# Altium schematic sheet IQModulatorWaveyRadar.SchDoc: IQ Modulator WaveyRadar Schematic
size Letter; Author: Will Vu; CompanyName: Raccoon Wireless; DrawnBy: Will Vu, Raccoon Wireless; Engineer: Will Vu; Organization: Raccoon Wireless; DocumentNumber: 2-08; Revision: 2; SheetNumber: 8; SheetTotal: 15
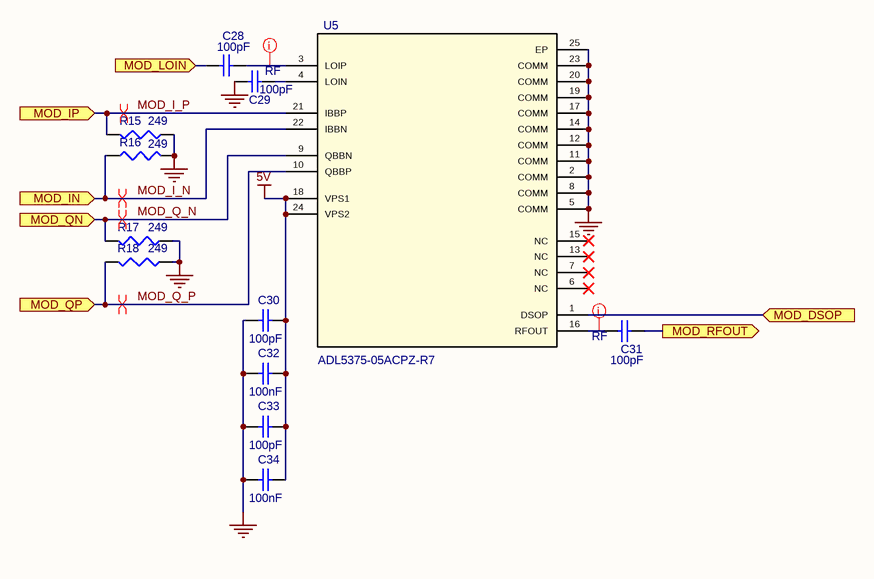
[diagram p0: IQModulatorWaveyRadar.SchDoc]

## Parts
C28  value 100pF  [CAPC1005X56X25LL10T15]  (hidden comment: 04023A101JAT2A)
C29  value 100pF  [CAPC1005X56X25LL10T15]  (hidden comment: 04023A101JAT2A)
C30  value 100pF  [CAPC1005X56X25LL10T15]  (hidden comment: 04023A101JAT2A)
C31  value 100pF  [CAPC1005X56X25LL10T15]  (hidden comment: 04023A101JAT2A)
C32  value 100nF  [CAPC0402(1005)60_L]  (hidden comment: Capacitor 100nF +/-20% 10V 0402)
C33  value 100pF  [CAPC1005X56X25LL10T15]  (hidden comment: 04023A101JAT2A)
C34  value 100nF  [CAPC0402(1005)60_L]  (hidden comment: Capacitor 100nF +/-20% 10V 0402)
R15  value 249  [RESC1005X40X25NL05T05]  (hidden comment: ERJ-2RKF2490X)
R16  value 249  [RESC1005X40X25NL05T05]  (hidden comment: ERJ-2RKF2490X)
R17  value 249  [RESC1005X40X25NL05T05]  (hidden comment: ERJ-2RKF2490X)
R18  value 249  [RESC1005X40X25NL05T05]  (hidden comment: ERJ-2RKF2490X)
U5  ADL5375-05ACPZ-R7  [CP_24_7_ADI]

## Ports
MOD_DSOP (in), MOD_IN (in), MOD_IP (in), MOD_LOIN (in), MOD_QN (in), MOD_QP (in), MOD_RFOUT (out)

## Nets
5V: C30.2 C32.2 C33.2 C34.2 U5.18(VPS1) U5.24(VPS2)
GND: C29.1 C30.1 C32.1 C33.1 C34.1 R15.1 R16.2 R17.1 R18.1 U5.2(COMM) U5.5(COMM) U5.8(COMM) U5.11(COMM) U5.12(COMM) U5.14(COMM) U5.17(COMM) U5.19(COMM) U5.20(COMM) U5.23(COMM) U5.25(EP)
MOD_DSOP: U5.1(DSOP) ; port MOD_DSOP
MOD_I_N: R16.1 U5.22(IBBN) ; port MOD_IN
MOD_I_P: R15.2 U5.21(IBBP) ; port MOD_IP
MOD_LOIN: C28.1 ; port MOD_LOIN
MOD_Q_N: R17.2 U5.9(QBBN) ; port MOD_QN
MOD_Q_P: R18.2 U5.10(QBBP) ; port MOD_QP
MOD_RFOUT: C31.2 ; port MOD_RFOUT
NetC28_2: C28.2 U5.3(LOIP)
NetC29_2: C29.2 U5.4(LOIN)
NetC31_1: C31.1 U5.16(RFOUT)

Not connected (* = marked no-connect by the designer): U5 6(NC)* 7(NC)* 13(NC)* 15(NC)*

## Layout directives
differential pair: MOD_I_N, MOD_I_P, MOD_Q_N, MOD_Q_P
net class RF: NetC28_2, NetC31_1

## Notes on the sheet
- /

## Library data of the parts
C28-C31 C33 = CMP-001-00083-2: AVX - 04023A101JAT2A - SMD Multilayer Ceramic Capacitor, 100 pF, 25 V, 0402 [1005 Metric], ± 5%, C0G / NP0, AVX 0402 MLCC
C32 C34 = CMP-001-00061-4: Chip Capacitor, 100nF +/-20%, 10V, 0402, Thickness 0.6 mm; Tolerance: 20%; Case/Package: 0402; Voltage Rating: 10V; Pins: 2; Mounting Technology: SMT; Max Operating Temperature: 85°C; Min Operating Temperature: -55°C
R15-R18 = CMP-009-00185-1: RESISTOR, 0402, 249R 1%, 0.1W
U5 = CMP-007-000001-5: IC MOD QUAD 400MHZ-6GHZ 24LFCSP; P1dB: 10.4dBm; Built_By: EMA_UL_Team; Output Power (dBm): 1.71dBm; Operating Supply Voltage: 5.25V; Supply Current: 174mA; Max Power Dissipation: 1.5W; Operating Supply Current: 200mA; SourceLibrary: Analog_2015-12-15; Vendor: Analog Devices Inc; Test Frequency: 3.5GHz; Source: 2021-05-25_00-39-48.SchLib; Case/Package: LFCSP EP; Type: DEV; Min Operating Temperature: -40°C; RoHS Compliant: Yes; Copyright: Copyright (C) 2018 Accelerated Designs. All rights reserved; Packaging: Tape and Reel; RefDes: RefDes; Radiation Hardening: No; Max Operating Temperature: 85°C; Design Item ID: ADL5375-05ACPZ-R7; Package Quantity: 1; Number of Pins: 24; Lead Free: Contains Lead; Nominal Supply Current: 174mA; Series: -; Manufacturer_Part_Number: ADL5375-05ACPZ-R7